# Altium schematic sheet TopSCH.SchDoc: FER_TEMPLATE
size A4; Author: Leon Baždar; CompanyName: FER; Address1: Zagreb; SheetNumber: 1; SheetTotal: 7
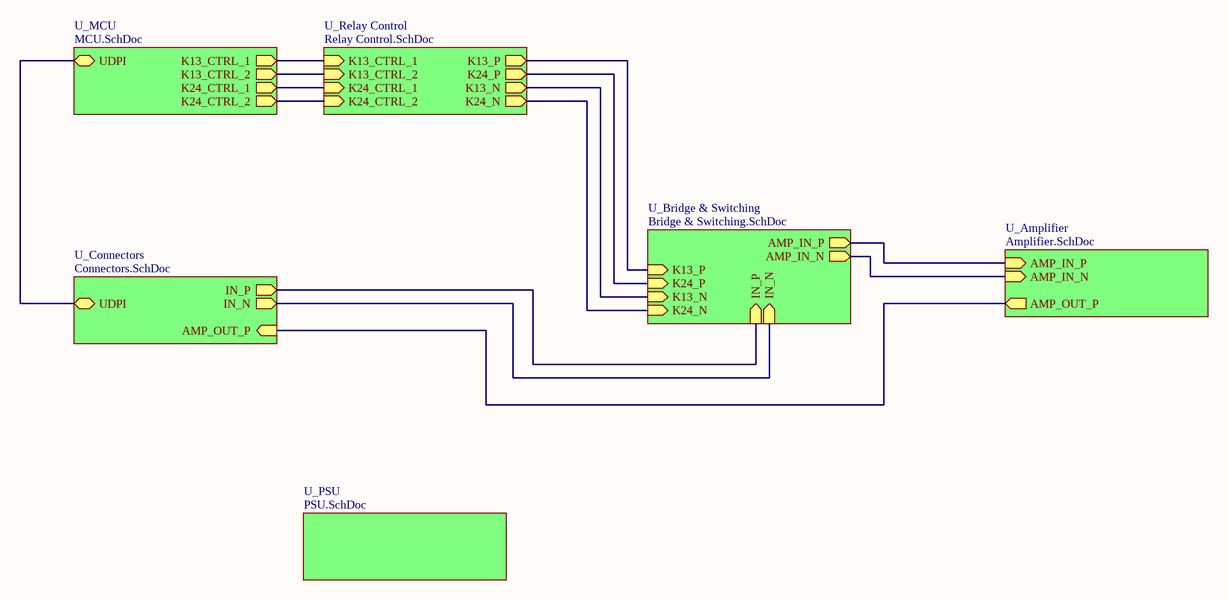
[diagram p0: TopSCH.SchDoc]

## Sub-sheets
U_Amplifier = Amplifier.SchDoc: AMP_IN_P (in), AMP_IN_N (in), AMP_OUT_P (out)
U_Bridge & Switching = Bridge & Switching.SchDoc: IN_P (in), IN_N (in), AMP_IN_P (out), AMP_IN_N (out), K13_P (in), K24_P (in), K13_N (in), K24_N (in)
U_Connectors = Connectors.SchDoc: IN_P (out), IN_N (out), AMP_OUT_P (in), UDPI (bidir)
U_MCU = MCU.SchDoc: K13_CTRL_1 (out), K13_CTRL_2 (out), K24_CTRL_1 (out), K24_CTRL_2 (out), UDPI (bidir)
U_PSU = PSU.SchDoc: no entries
U_Relay Control = Relay Control.SchDoc: K13_P (out), K24_P (out), K13_N (out), K24_N (out), K13_CTRL_1 (in), K13_CTRL_2 (in), K24_CTRL_1 (in), K24_CTRL_2 (in)

## Nets
(unnamed): sheet U_Amplifier/AMP_IN_P, sheet U_Bridge & Switching/AMP_IN_P
(unnamed): sheet U_Amplifier/AMP_IN_N, sheet U_Bridge & Switching/AMP_IN_N
(unnamed): sheet U_Amplifier/AMP_OUT_P, sheet U_Connectors/AMP_OUT_P
(unnamed): sheet U_Bridge & Switching/IN_P, sheet U_Connectors/IN_P
(unnamed): sheet U_Bridge & Switching/IN_N, sheet U_Connectors/IN_N
(unnamed): sheet U_Bridge & Switching/K13_P, sheet U_Relay Control/K13_P
(unnamed): sheet U_Bridge & Switching/K24_P, sheet U_Relay Control/K24_P
(unnamed): sheet U_Bridge & Switching/K13_N, sheet U_Relay Control/K13_N
(unnamed): sheet U_Bridge & Switching/K24_N, sheet U_Relay Control/K24_N
(unnamed): sheet U_MCU/K13_CTRL_1, sheet U_Relay Control/K13_CTRL_1
(unnamed): sheet U_MCU/K13_CTRL_2, sheet U_Relay Control/K13_CTRL_2
(unnamed): sheet U_MCU/K24_CTRL_1, sheet U_Relay Control/K24_CTRL_1
(unnamed): sheet U_MCU/K24_CTRL_2, sheet U_Relay Control/K24_CTRL_2
(unnamed): sheet U_MCU/UDPI, sheet U_Connectors/UDPI

## Notes on the sheet
- Project:
- File:
- Size:
- A4
- Author:
- Revision:
- Date:
- Sheet
- of